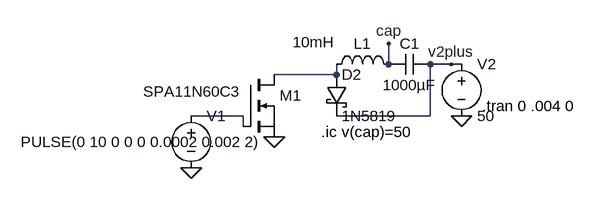
[diagram p0: schematic idea1.asc]
idea1.asc, the LTspice schematic file:
Version 4
SHEET 1 880 680
WIRE 80 48 80 16
WIRE 176 48 144 48
WIRE 192 48 176 48
WIRE 0 64 0 48
WIRE 0 64 -96 64
WIRE -144 128 -224 128
WIRE 144 128 144 48
WIRE 144 128 0 128
WIRE -144 144 -144 128
FLAG 192 128 0
FLAG -224 208 0
FLAG -96 160 0
FLAG 176 48 v2plus
FLAG 80 16 cap
SYMBOL voltage -224 112 R0
WINDOW 3 -262 56 Left 2
WINDOW 123 0 0 Left 2
WINDOW 39 0 0 Left 2
SYMATTR InstName V1
SYMATTR Value PULSE(0 10 0 0 0 0.0002 0.002 2)
SYMBOL ind -16 64 R270
WINDOW 0 32 56 VTop 2
WINDOW 3 66 -19 VBottom 2
SYMATTR InstName L1
SYMATTR Value 10mH
SYMATTR SpiceLine Rser=.001
SYMBOL cap 80 64 R270
WINDOW 0 32 32 VTop 2
WINDOW 3 0 32 VBottom 2
SYMATTR InstName C1
SYMATTR Value 1000µF
SYMBOL nmos -144 64 R0
WINDOW 3 -154 26 Left 2
SYMATTR InstName M1
SYMATTR Value SPA11N60C3
SYMBOL voltage 192 32 R0
WINDOW 123 0 0 Left 2
WINDOW 39 0 0 Left 2
SYMATTR InstName V2
SYMATTR Value 50
SYMBOL schottky -16 64 R0
SYMATTR InstName D2
SYMATTR Value 1N5819
SYMATTR Description Diode
SYMATTR Type diode
TEXT 224 112 Left 2 !.tran 0 .004 0
TEXT -24 152 Left 2 !.ic v(cap)=50

The netlist it stands for:
* idea1.asc
V1 N002 0 PULSE(0 10 0 0 0 0.0002 0.002 2)
L1 N001 cap 10mH Rser=.001
C1 cap v2plus 1000µF
M1 N001 N002 0 0 SPA11N60C3
V2 v2plus 0 50
D2 N001 v2plus 1N5819
.model D D
.lib standard.dio
.model NMOS NMOS
.model PMOS PMOS
.lib standard.mos
.tran 0 .004 0
.ic v(cap)=50
.backanno
.end